# EAGLE design SMARTCONTROL2 (EAGLE 9.6.2)
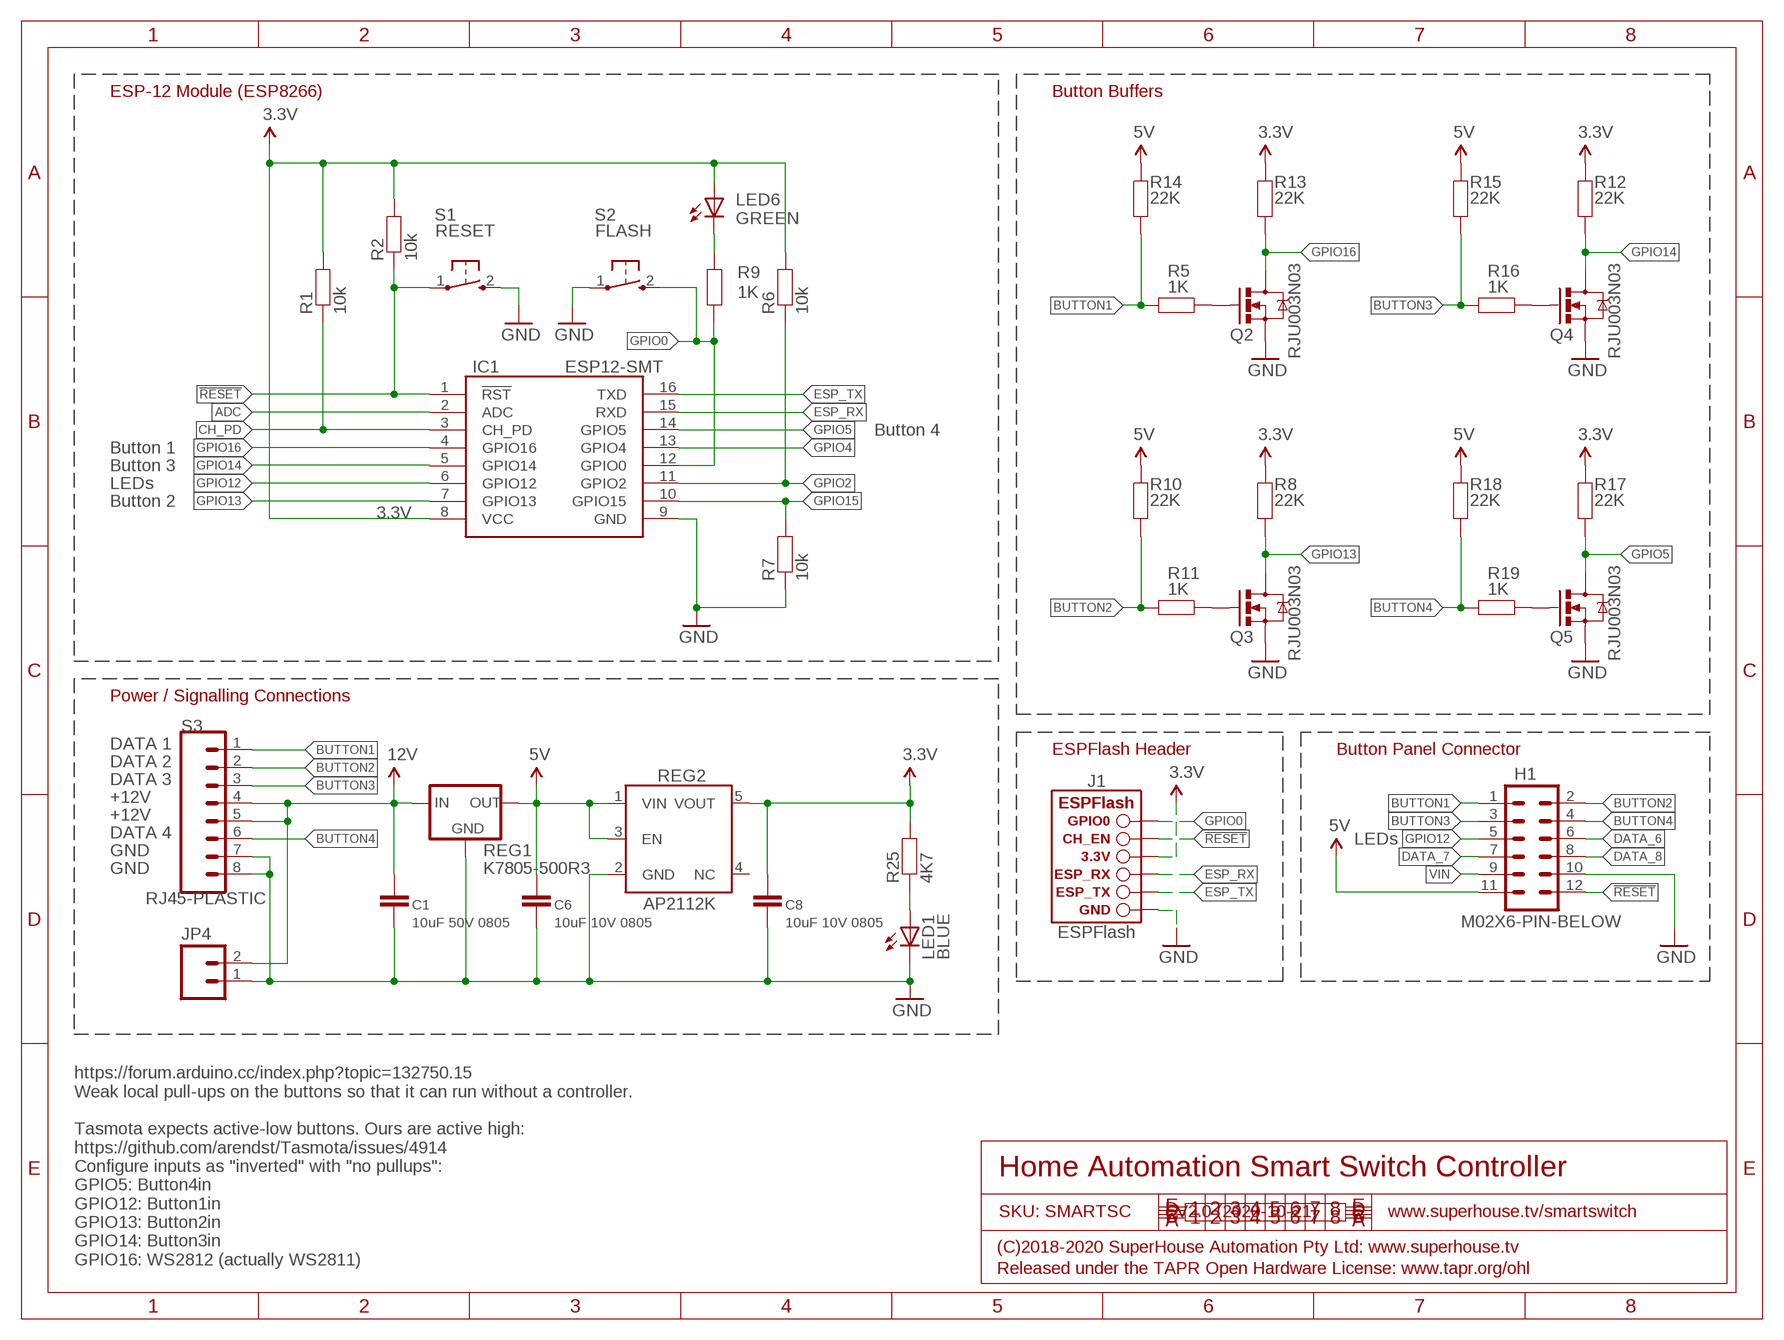
[diagram p0: schematic, sheet 1]

## Parts
C1  10uF 50V 0805  CAP0805  [C0805]
C6  10uF 10V 0805  CAP0805  [C0805]
C8  10uF 10V 0805  CAP0805  [C0805]
H1  M02X6-PIN-BELOW  [2X06-P-BELOW]
IC1  ESP12-SMT  [ESP12]
J1  ESPFLASH-1X6-2.54-SOCKET  [1X6-2.54-SOCKET]
JP4  M02-SCREW-5MM  [SCREWTERMINAL-5MM-2]
LED1  BLUE  LED0603  [LED-0603]
LED6  GREEN  LED0603  [LED-0603]
Q2  RJU003N03  MOSFET-NCHANNEL-323  [SOT32-3]
Q3  RJU003N03  MOSFET-NCHANNEL-323  [SOT32-3]
Q4  RJU003N03  MOSFET-NCHANNEL-323  [SOT32-3]
Q5  RJU003N03  MOSFET-NCHANNEL-323  [SOT32-3]
R1  10k  RESISTOR0603  [R0603]
R2  10k  RESISTOR0603  [R0603]
R5  1K  RESISTOR0603  [R0603]
R6  10k  RESISTOR0603  [R0603]
R7  10k  RESISTOR0603  [R0603]
R8  22K  RESISTOR0603  [R0603]
R9  1K  RESISTOR0603  [R0603]
R10  22K  RESISTOR0603  [R0603]
R11  1K  RESISTOR0603  [R0603]
R12  22K  RESISTOR0603  [R0603]
R13  22K  RESISTOR0603  [R0603]
R14  22K  RESISTOR0603  [R0603]
R15  22K  RESISTOR0603  [R0603]
R16  1K  RESISTOR0603  [R0603]
R17  22K  RESISTOR0603  [R0603]
R18  22K  RESISTOR0603  [R0603]
R19  1K  RESISTOR0603  [R0603]
R25  4K7  RESISTOR0603  [R0603]
REG1  K7805-500R3  78XX-K78XX-VERTICAL  [K78XX-500R3]
REG2  AP2112KSOT25  [SOT23-5]
S1  RESET  TAC_SWITCH_2PINSMT  [TACTILE_SMT_3X4X2]
S2  FLASH  TAC_SWITCH_2PINSMT  [TACTILE_SMT_3X4X2]
S3  RJ45-PLASTIC  [RJ45]

## Nets
3.3V: C8.1 IC1.8(VCC) J1.4(3.3V) LED6.A R1.2 R2.2 R6.2 R8.2 R12.2 R13.2 R17.2 R25.2 REG2.5(VOUT)
5V: C6.1 H1.11 R10.2 R14.2 R15.2 R18.2 REG1.3(OUT) REG2.1(VIN) REG2.3(EN)
12V: C1.1 JP4.2 REG1.1(IN) S3.4 S3.5
!RESET: H1.12 IC1.1(!RST) J1.5(CH_EN) R2.1 S1.1(P)
ADC: IC1.2(ADC)
BUTTON1: H1.1 R5.2 R14.1 S3.1
BUTTON2: H1.2 R10.1 R11.2 S3.2
BUTTON3: H1.3 R15.1 R16.2 S3.3
BUTTON4: H1.4 R18.1 R19.2 S3.6
CH_PD: IC1.3(CH_PD) R1.1
DATA_6: H1.6
DATA_7: H1.7
DATA_8: H1.8
ESP_RX: IC1.15(RXD) J1.3(ESP_RX)
ESP_TX: IC1.16(TXD) J1.2(ESP_TX)
GND: C1.2 C6.2 C8.2 H1.10 IC1.9(GND) J1.1(GND) JP4.1 LED1.C Q2.2(S) Q3.2(S) Q4.2(S) Q5.2(S) R7.1 REG1.2(GND) REG2.2(GND) S1.2(S) S2.1(P) S3.7 S3.8
GPIO0: IC1.12(GPIO0) J1.6(GPIO0) R9.2 S2.2(S)
GPIO2: IC1.11(GPIO2) R6.1
GPIO4: IC1.13(GPIO4)
GPIO5: IC1.14(GPIO5) Q5.3(D) R17.1
GPIO12: H1.5 IC1.6(GPIO12)
GPIO13: IC1.7(GPIO13) Q3.3(D) R8.1
GPIO14: IC1.5(GPIO14) Q4.3(D) R12.1
GPIO15: IC1.10(GPIO15) R7.2
GPIO16: IC1.4(GPIO16) Q2.3(D) R13.1
N$1: Q2.1(G) R5.1
N$2: Q3.1(G) R11.1
N$3: Q4.1(G) R16.1
N$4: Q5.1(G) R19.1
N$23: LED1.A R25.1
N$27: LED6.C R9.1
VIN: H1.9
Unconnected: REG2.4(NC)

## Notes on the sheet
- ESP-12 Module (ESP8266) | Button Buffers
- Button 4
- Button 1
- Button 3
- LEDs
- Button 2
- Power / Signalling Connections
- DATA 1
- ESPFlash Header | Button Panel Connector
- DATA 2
- DATA 3
- +12V
- +12V
- DATA 4 | LEDs
- GND
- GND
- Home Automation Smart Switch Controller
- SKU: SMARTSC | V2.0 (2020-10-21) | www.superhouse.tv/smartswitch
- (C)2018-2020 SuperHouse Automation Pty Ltd: www.superhouse.tv
- https://forum.arduino.cc/index.php?topic=132750.15
  Weak local pull-ups on the buttons so that it can run without a controller.
  
  Tasmota expects active-low buttons. Ours are active high:
  https://github.com/arendst/Tasmota/issues/4914
  Configure inputs as "inverted" with "no pullups":
  GPIO5: Button4in
  GPIO12: Button1in
  GPIO13: Button2in
  GPIO14: Button3in
  GPIO16: WS2812 (actually WS2811)
- Released under the TAPR Open Hardware License: www.tapr.org/ohl

## Library data of the parts
C1 C6 C8 = SuperHouse-DiscreteSemi:CAP: Capacitor Standard ceramic capacitor
H1 = SuperHouse-Connectors:M02X6: M12 header in 2x6 format
IC1 = SuperHouse-MCUs:ESP12: ESP-12 module
J1 = SuperHouse-ESPFlash:ESPFLASH: ESP-Prog ESP-Prog programming header for ESP8266, ESP8285, and ESP32. Options for both 1x6 and 2x3 formats, in 2.54mm (0.1") and 1.27mm (0.05") pitch.
JP4 = SuperHouse-Connectors:M02: 2-way header Standard 1x2 header, and screw terminal variations
LED1 LED6 = SuperHouse-LEDs:LED: LEDs Standard schematic elements and footprints for 5mm, 3mm, 1206, and 0603 sized LEDs. 5mm - Spark Fun Electronics SKU : COM-00529 (and others)
Q2-Q5 = SuperHouse-DiscreteSemi:MOSFET-NCHANNEL: N-channel MOSFET
R1 R2 R5-R19 R25 = SuperHouse-DiscreteSemi:RESISTOR: Resistor Standard resistors.
REG1 = SuperHouse-Regulators:78XX: L78xx (linear) and K78xx (switching) voltage regulators
REG2 = SuperHouse-Regulators:AP2112K: AP2112K LDO linear voltage regulator
S1 S2 = SuperHouse-Switches:TAC_SWITCH_2PIN: Momentary Tactile Switch - 2 pin Uxcell 3x4x2mm switch with 2 SMT pads
S3 = SuperHouse-Connectors:RJ45: RJ45 socket

## Net classes
0 Default: width 0.203 mm
1 VCC: width 0.305 mm

## Board
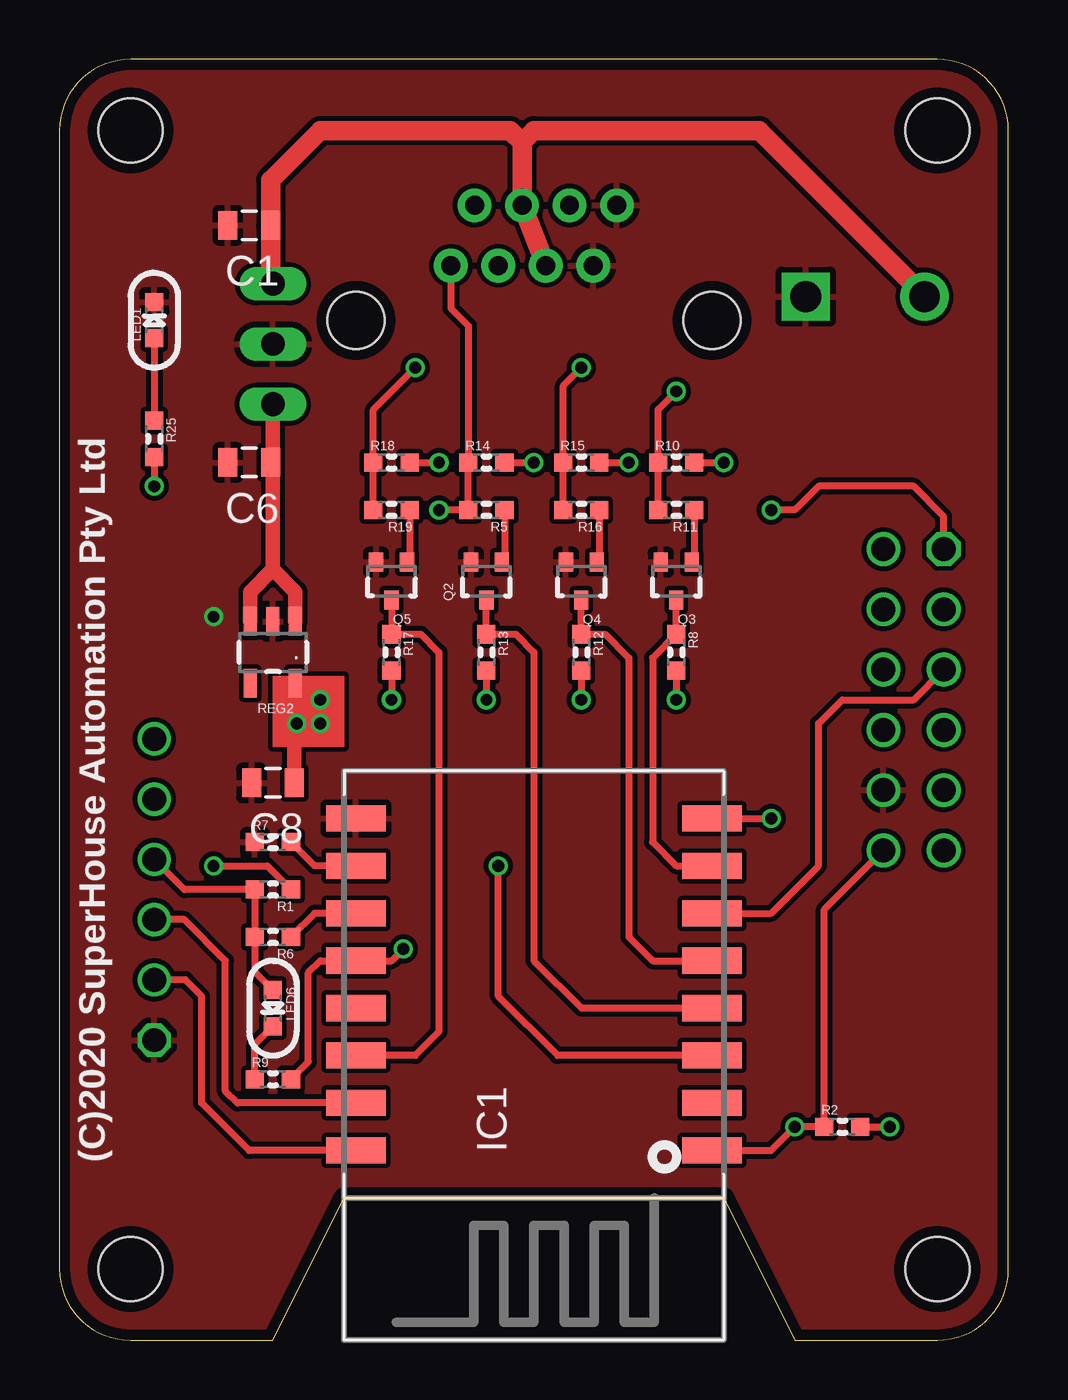
[diagram p1: board, top side]
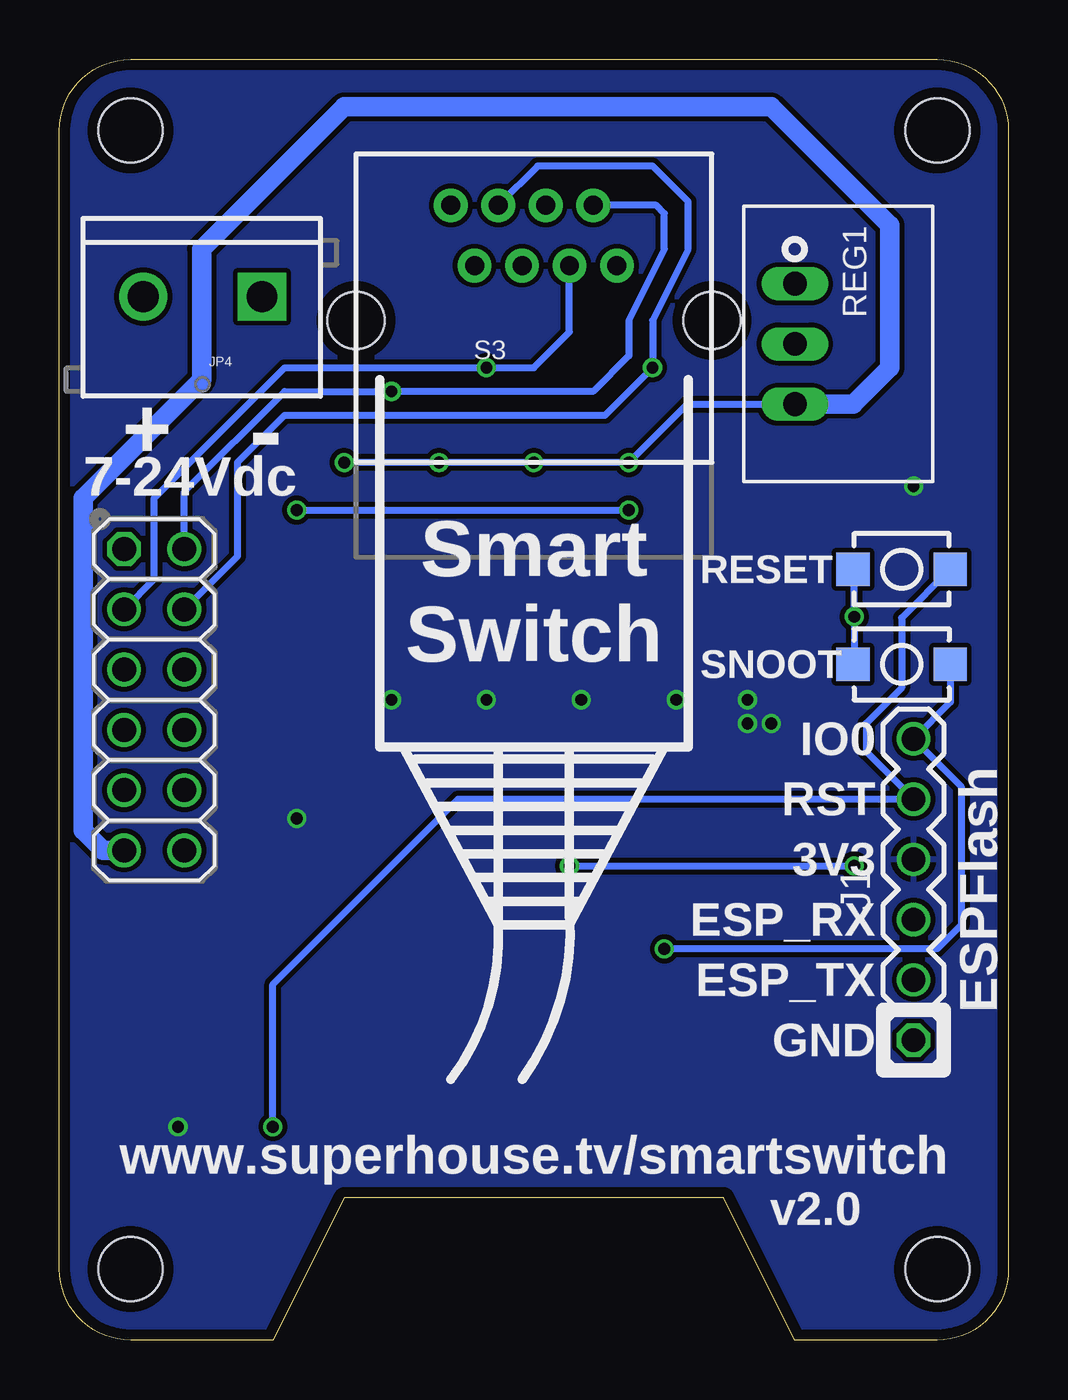
[diagram p2: board, bottom side, seen from below]

Size 40 x 54 mm. Coordinates in mm from the lower left corner, seen from the top.
Outline: 3,0 9,0 12,6 28,6 31,0 37,0 arc90 40,3 40,51 arc90 37,54 3,54 arc90 0,51 0,3 arc90 3,0
Copper layers (1*16): Top 0.035mm / dielectric 1.5mm / Bottom 0.035mm
Design rules "default *": minimum track width 8mil, minimum drill 15mil, track to track 8mil, track to pad 8mil, pad to pad 8mil, via to via 8mil, smd to smd 8mil, copper to edge 18mil, drill to drill 8mil, minimum pad ring 8mil, minimum via ring 6mil, stop-mask expansion 4mil, vias tented up to drill 25mil, thermal gap 10mil
Holes 2.7 mm at 37,3 37,51 3,51 3,3

### Footprints (pad centres in the part's own frame; a part is rotated, then mirrored left to right if it is on the bottom)
C0805 = smd 0.8 x 1.2: 1 -0.9,0; 2 0.9,0
2X06-P-BELOW = drill 1.016 octagon: 1 -6.35,-1.27 | drill 1.016: 2 -6.35,1.27; 3 -3.81,-1.27; 4 -3.81,1.27; 5 -1.27,-1.27; 6 -1.27,1.27; 7 1.27,-1.27; 8 1.27,1.27; 9 3.81,-1.27; 10 3.81,1.27; 11 6.35,-1.27; 12 6.35,1.27
ESP12 = smd 1.1 x 2.5: 1 -4,-7.5; 2 -2,-7.5; 3 0,-7.5; 4 2,-7.5; 5 4,-7.5; 6 6,-7.5; 7 8,-7.5; 8 10,-7.5; 9 10,7.5; 10 8,7.5; 11 6,7.5; 12 4,7.5; 13 2,7.5; 14 0,7.5; 15 -2,7.5; 16 -4,7.5
1X6-2.54-SOCKET = drill 1 octagon: 1 -6.35,0 | drill 1: 2 -3.81,0; 3 -1.27,0; 4 1.27,0; 5 3.81,0; 6 6.35,0
SCREWTERMINAL-5MM-2 = drill 1.3 pad 2.032 square: 1 -2.54,0 | drill 1.3 pad 2.032: 2 2.46,0
LED-0603 = smd 0.762 x 0.762: A -0.762,0; C 0.762,0
SOT32-3 = smd 0.6 x 0.8: 1 -0.65,-0.8; 2 0.65,-0.8; 3 0,0.8
R0603 = smd 0.762 x 0.762: 1 -0.762,0; 2 0.762,0
K78XX-500R3 = drill 1 long: 1 -2.54,0; 2 0,0; 3 2.54,0
SOT23-5 = smd 0.55 x 1.2: 1 -0.95,-1.3; 2 0,-1.3; 3 0.95,-1.3; 4 0.95,1.3; 5 -0.95,1.3
TACTILE_SMT_3X4X2 = smd 1.4 x 1.4: 1 -2.05,0; 2 2.05,0
RJ45 = drill 0.8 pad 1.422: 1 3.5,2.3; 2 2.5,4.84; 3 1.5,2.3; 4 0.5,4.84; 5 -0.5,2.3; 6 -1.5,4.84; 7 -2.5,2.3; 8 -3.5,4.84 | hole 2.4: -7.5,0; 7.5,0

### Placement (x,y rotation side)
C1  8,47 180 top
C6  8,37 180 top
C8  9,23.5 180 top
H1  36,27 270 bottom
IC1  20,12 90 top
J1  4,19 90 bottom
JP4  34,44 180 bottom
LED1  4,43 90 top
LED6  9,14 270 top
Q2  18,32 180 top
Q3  26,32 180 top
Q4  22,32 180 top
Q5  14,32 180 top
R1  9,19 180 top
R2  33,9 0 top
R5  18,35 180 top
R6  9,17 180 top
R7  9,21 0 top
R8  26,29 270 top
R9  9,11 0 top
R10  26,37 0 top
R11  26,35 180 top
R12  22,29 270 top
R13  18,29 270 top
R14  18,37 0 top
R15  22,37 0 top
R16  22,35 180 top
R17  14,29 270 top
R18  14,37 0 top
R19  14,35 180 top
R25  4,38 270 top
REG1  9,42 270 bottom
REG2  9,29 180 top
S1  4.5,32.5 180 bottom
S2  4.5,28.5 0 bottom
S3  20,43 0 bottom

### Tracks (layer width: path | path; a pad name or v marks a point on that pad's centre or on a via)
3.3V  (via drill 0.5)
  Top 0.305: 9,15 LED6.A 8.24,15.52 R6.2 R1.2 5.27,19 J1.4 | R25.2 v4,36 | v10,26 v11,26 v11,27 10.65,27 REG2.5 | R17.2 v14,27 | R13.2 v18,27 | R12.2 v22,27 | R8.2 v26,27 | R2.2 v35,9 | IC1.8 v30,22
  Top 0.61: C8.1 9.9,25.9 v10,26
  Bottom 0.305: v35,9 35,8.85
  pour Bottom: 3,54 37,54 arc-90 40,51 40,3 arc-90 37,0 31,0 28,6 12,6 9,0 3,0 arc-90 0,3 0,51 arc-90
5V  (via drill 0.5)
  Top 0.305: R18.2 v16,37 | R14.2 v20,37 | R15.2 v24,37 | R10.2 v28,37
  Top 0.61: 9,32.5 8.05,31.55 REG2.3 | 9,36.9 C6.1 | 9,32.5 9.95,31.55 REG2.1 | REG1.3 9,36.9 | 9,36.9 9,32.5
  Bottom 0.305: v28,37 v24,37 v20,37 v16,37 13.54,39.46 REG1.3
  Bottom 0.813: REG1.3 6.54,39.46 5,41 5,47 10,52 28,52 34,46 34,40.5 39,35.5 39,21.5 38.15,20.65 H1.11
12V
  Top 0.813: S3.5 S3.4 19.5,50.5 | 19.5,50.5 19,51 11,51 8.9,48.9 C1.1 8.9,44.64 REG1.1 | 19.5,50.5 20,51 29.5,51 36.46,44.04 JP4.2
!RESET  (via drill 0.5)
  Top 0.305: IC1.1 30,8 v31,9 R2.1 32.24,18.16 H1.12
  Bottom 0.305: v31,9 31,15 23.19,22.81 J1.5 6,24.81 6,26 4.5,27.5 4.5,30.45 S1.1
BUTTON1  (via drill 0.5)
  Top 0.305: S3.1 16.5,43.5 17.24,42.76 R14.1 R5.2 v16,35 | H1.1 37.27,34.73 36,36 32,36 31,35 v30,35
  Bottom 0.305: v30,35 v16,35
BUTTON2  (via drill 0.5)
  Top 0.305: R11.2 R10.1 25.24,39.24 v26,40
  Bottom 0.305: S3.2 14.84,47.84 14.5,47.5 14.5,46 16,43 16,41.5 17.5,40 v26,40 30.5,40 34.73,35.77 H1.2
BUTTON3  (via drill 0.5)
  Top 0.305: R16.2 R15.1 21.24,40.24 v22,41
  Bottom 0.305: S3.3 18.5,42.5 20,41 v22,41 30.5,41 36,35.5 36,32.08 H1.3
BUTTON4  (via drill 0.5)
  Top 0.305: R19.2 R18.1 13.24,39.24 v15,41
  Bottom 0.305: H1.4 32.5,33.04 32.5,37 30.5,39 17,39 v15,41 15,43 13.5,46 13.5,48 15,49.5 19.84,49.5 S3.6
CH_PD  (via drill 0.5)
  Top 0.305: IC1.3 21,12 18.5,14.5 v18.5,20 | v6.5,20 8.76,20 R1.1
  Bottom 0.305: v18.5,20 v6.5,20
ESP_RX
  Top 0.305: J1.3 5.27,17.73 7,16 7,10.5 7.5,10 IC1.15
ESP_TX
  Top 0.305: J1.2 5.31,15.19 6,14.5 6,10 8,8 IC1.16
GND  (via drill 0.5)
  Bottom 0.305: 6.5,32.55 S1.2 6.5,32.45 v6.5,30.5 6.5,28.55 S2.1
  pour Top: 3,54 37,54 arc-90 40,51 40,3 arc-90 37,0 31,0 28,6 12,6 9,0 3,0 arc-90 0,3 0,51 arc-90
GPIO0  (via drill 0.5)
  Top 0.305: v14.5,16.5 14,16 IC1.12 11,16 10.5,15.5 10.5,11.74 R9.2
  Bottom 0.305: v14.5,16.5 3,16.5 2,17.5 2,23.35 J1.6 2.45,26.9 S2.2
GPIO2
  Top 0.305: 10,16.76 R6.1 10.76,18 IC1.11
GPIO5
  Top 0.305: Q5.3 R17.1 15.24,29.76 16,29 16,13 15,12 IC1.14
GPIO12
  Top 0.305: IC1.6 30,18 32,20 32,26 33,27 36,27 H1.5
GPIO13
  Top 0.305: Q3.3 R8.1 25,28.76 25,21 26,20 IC1.7
GPIO14
  Top 0.305: Q4.3 R12.1 23,29.76 24,28.76 24,17 25,16 IC1.5
GPIO15
  Top 0.305: IC1.10 10.76,20 R7.2
GPIO16
  Top 0.305: Q2.3 R13.1 19.24,29.76 20,29 20,16 22,14 IC1.4
N$1
  Top 0.305: R5.1 18.76,32.91 Q2.1
N$2
  Top 0.305: R11.1 26.76,32.91 Q3.1
N$3
  Top 0.305: R16.1 22.76,32.91 Q4.1
N$4
  Top 0.305: 14.65,32.96 Q5.1 14.76,32.91 R19.1
N$23
  Top 0.305: LED1.A R25.1
N$27
  Top 0.305: 8.24,10.98 R9.1 8.24,12.48 LED6.C
(copper drawn outside any net)
  shapes: Top area x1

### Text on the board
tPlace: (C)2020 SuperHouse Automation Pty Ltd
bPlace: - | + | 7-24Vdc | RESET | Smart / Switch | SNOOT | IO0 | RST | 3V3 | ESPFlash | ESP_RX | ESP_TX | GND | www.superhouse.tv/smartswitch | v2.0